# EAGLE design stm32f103c8_stlink (EAGLE 7.6.0)
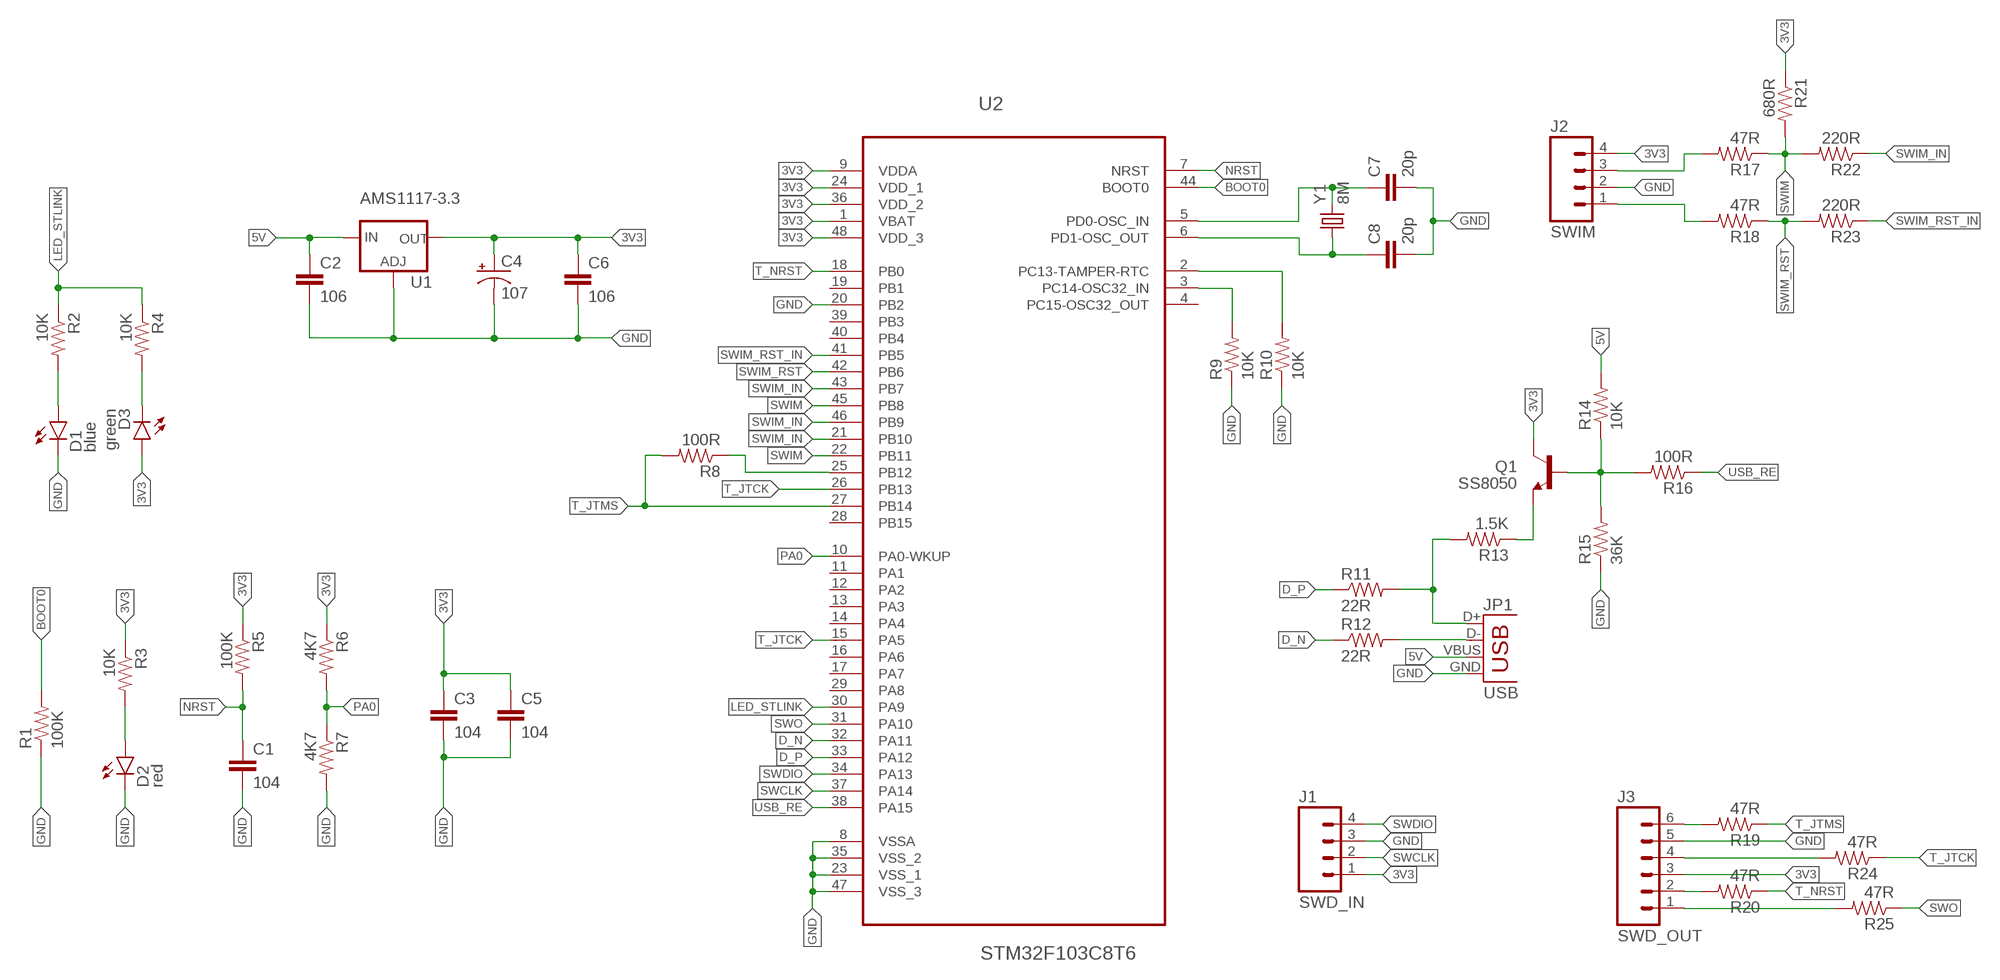
[diagram p0: schematic, sheet 1]

## Parts
C1  104  CAP0603-CAP  [0603-CAP]
C2  106  CAP0603-CAP  [0603-CAP]
C3  104  CAP0603-CAP  [0603-CAP]
C4  107  CAP_POL3528  [EIA3528]
C5  104  CAP0603-CAP  [0603-CAP]
C6  106  CAP0603-CAP  [0603-CAP]
C7  20p  CAP0603-CAP  [0603-CAP]
C8  20p  CAP0603-CAP  [0603-CAP]
D1  blue  LED-SEEED-0603  [LED-0603-SEEED]
D2  red  LED-SEEED-0603  [LED-0603-SEEED]
D3  green  LED-SEEED-0603  [LED-0603-SEEED]
J1  SWD_IN  M041X04_NO_SILK  [1X04_NO_SILK]
J2  SWIM  M041X04_NO_SILK  [1X04_NO_SILK]
J3  SWD_OUT  M06NO_SILK_FEMALE_PTH  [1X06_NO_SILK]
JP1  USB  [MICROUSB-U-F-M5DD-Y-1]
Q1  SS8050  TRANSISTOR_NPN-JLC-SMT  [SOT23-3]
R1  100K  RESISTOR0603  [0603-RES]
R2  10K  RESISTOR0603  [0603-RES]
R3  10K  RESISTOR0603  [0603-RES]
R4  10K  RESISTOR0603  [0603-RES]
R5  100K  RESISTOR0603  [0603-RES]
R6  4K7  RESISTOR0603  [0603-RES]
R7  4K7  RESISTOR0603  [0603-RES]
R8  100R  RESISTOR0603  [0603-RES]
R9  10K  RESISTOR0603  [0603-RES]
R10  10K  RESISTOR0603  [0603-RES]
R11  22R  RESISTOR0603  [0603-RES]
R12  22R  RESISTOR0603  [0603-RES]
R13  1.5K  RESISTOR0603  [0603-RES]
R14  10K  RESISTOR0603  [0603-RES]
R15  36K  RESISTOR0603  [0603-RES]
R16  100R  RESISTOR0603  [0603-RES]
R17  47R  RESISTOR0603  [0603-RES]
R18  47R  RESISTOR0603  [0603-RES]
R19  47R  RESISTOR0603  [0603-RES]
R20  47R  RESISTOR0603  [0603-RES]
R21  680R  RESISTOR0603  [0603-RES]
R22  220R  RESISTOR0603  [0603-RES]
R23  220R  RESISTOR0603  [0603-RES]
R24  47R  RESISTOR0603  [0603-RES]
R25  47R  RESISTOR0603  [0603-RES]
U1  AMS1117-3.3  AMS1117SOT223  [SOT223]
U2  STM32F103C8T6  STM32F103CBT6  [LQFP-48]
Y1  8M  CRYSTALHC49US  [HC49US]

## Nets
3V3: C3.1 C4.A(+) C5.1 C6.1 D3.+(A) J1.1 J2.4 J3.3 Q1.3(C) R3.1 R5.1 R6.1 R21.1 U1.2(OUT) U1.4(OUT) U2.1(VBAT) U2.9(VDDA) U2.24(VDD_1) U2.36(VDD_2) U2.48(VDD_3)
5V: C2.1 JP1.VBUS R14.2 U1.3(IN)
BOOT0: R1.2 U2.44(BOOT0)
D_N: R12.1 U2.32(PA11)
D_P: R11.1 U2.33(PA12)
GND: C1.2 C2.2 C3.2 C4.C(-) C5.2 C6.2 C7.2 C8.2 D1.-(C) D2.-(C) J1.3 J2.2 J3.5 JP1.GND R1.1 R7.2 R9.1 R10.1 R15.1 U1.1(ADJ) U2.8(VSSA) U2.20(PB2) U2.23(VSS_1) U2.35(VSS_2) U2.47(VSS_3)
LED_STLINK: R2.1 R4.1 U2.30(PA9)
N$1: J3.6 R19.2
N$2: J2.3 R17.2
N$3: C7.1 U2.5(PD0-OSC_IN) Y1.2
N$4: C8.1 U2.6(PD1-OSC_OUT) Y1.1
N$5: D2.+(A) R3.2
N$6: Q1.2(E) R13.1
N$7: D1.+(A) R2.2
N$8: R10.2 U2.2(PC13-TAMPER-RTC)
N$9: R9.2 U2.3(PC14-OSC32_IN)
N$10: D3.-(C) R4.2
N$11: Q1.1(B) R14.1 R15.2 R16.2
N$12: R8.1 U2.25(PB12)
N$14: J2.1 R18.2
N$15: J3.4 R24.2
N$17: J3.2 R20.2
N$18: J3.1 R25.2
NRST: C1.1 R5.2 U2.7(NRST)
PA0: R6.2 R7.1 U2.10(PA0-WKUP)
SWCLK: J1.2 U2.37(PA14)
SWDIO: J1.4 U2.34(PA13)
SWIM: R17.1 R21.2 R22.2 U2.22(PB11) U2.45(PB8)
SWIM_IN: R22.1 U2.21(PB10) U2.43(PB7) U2.46(PB9)
SWIM_RST: R18.1 R23.2 U2.42(PB6)
SWIM_RST_IN: R23.1 U2.41(PB5)
SWO: R25.1 U2.31(PA10)
T_JTCK: R24.1 U2.15(PA5) U2.26(PB13)
T_JTMS: R8.2 R19.1 U2.27(PB14)
T_NRST: R20.1 U2.18(PB0)
USB_N [diffpair]: JP1.D- R12.2
USB_P [diffpair]: JP1.D+ R11.2 R13.2
USB_RE: R16.1 U2.38(PA15)
Unconnected: U2.4(PC15-OSC32_OUT) U2.11(PA1) U2.12(PA2) U2.13(PA3) U2.14(PA4) U2.16(PA6) U2.17(PA7) U2.19(PB1) U2.28(PB15) U2.29(PA8) U2.39(PB3) U2.40(PB4)

## Library data of the parts
C1-C3 C5-C8 = z_jlc_smt:CAP: Capacitor Standard 0603 ceramic capacitor, and 0.1" leaded capacitor.
C4 = z_jlc_smt:CAP_POL: Capacitor Polarized These are standard SMD and PTH capacitors. Normally 10uF, 47uF, and 100uF in electrolytic and tantalum varieties. Always verify the external diameter of the through hole cap, it varies with capacity, voltage, and manufacturer. The EIA devices should be standard.
D1-D3 = z_jlc_smt:LED: LEDs Standard schematic elements and footprints for 5mm, 3mm, 1206, and 0603 sized LEDs. 5mm - Spark Fun Electronics SKU : COM-00529 (and others)
J1 J2 = SparkFun-Connectors:M04: Header 4 Standard 4-pin 0.1" header. Use with straight break away headers (SKU : PRT-00116), right angle break away headers (PRT-00553), swiss pins (PRT-00743), machine pins (PRT-00117), and female headers (PRT-00115). Molex polarized connector foot print use with SKU : PRT-08231 with associated crimp pins and housings. 1MM SMD Version SKU: PRT-10208; PROD_ID: CONN-09696
J3 = SparkFun-Connectors:M06: Header 6 Standard 6-pin 0.1" header. Use with straight break away headers (SKU : PRT-00116), right angle break away headers (PRT-00553), swiss pins (PRT-00743), machine pins (PRT-00117), and female headers (PRT-00115). Molex polarized connector foot print use with SKU : PRT-08094 with associated crimp pins and housings. NOTES ON THE VARIANTS LOCK and LOCK_LONGPADS... This footprint was designed to help hold the alignment of a through-hole component (i.e. 6-pin header) while soldering it into place. You may notice that each hole has been shifted either up or down by 0.005 of an inch from it's more standard position (which is a perfectly straight line). This slight alteration caused the pins (the squares in the middle) to touch the edges of the holes. Because they are alternating, it causes a "brace" to hold the component in place. 0.005 has proven to be the perfect amount of "off-center" position when using our standard breakaway headers. Although looks a little odd when you look at the bare footprint, once you have a header in there, the alteration is very hard to notice. Also,if you push a header all the way into place, it is covered up entirely on the bottom side. This idea of altering the position of holes to aid alignment will be further integrated into the Sparkfun Library for other footprints. It can help hold any component with 3 or more connection pins.; PROD_ID: CONN-08437
JP1 = xmgu2008:USB: USB Connectors USB-B-PTH is fully proven SKU : PRT-00139/CONN-08278 USB-miniB is fully proven SKU : PRT-00587 USB-A-PCB is untested. USB-A-H is throughly reviewed, but untested. Spark Fun Electronics SKU : PRT-00437 USB-B-SMT is throughly reviewed, but untested. Needs silkscreen touching up. USB-A-S has not been used/tested USB-MB-H has not been used/tested USB-MICROB has been used. CONN-09505
Q1 = z_jlc_smt:TRANSISTOR_NPN: Generic NPN BJT MMBT2222A - TRANS-08049 (SOT-23, 1A 40V) MPSA42 - TRANS-09116 (SOT-23, 500mA 300V) MMBT5088LT1G - TRANS-11160 (SOT-23, 50 mA 30V) BC547 - COM-08928 <http://www.sparkfun.com/products/8928> (TO-92 45V 100mA) (1.Collector 2.Base 3.Emitter) 2N3904 - COM-00521 <http://www.sparkfun.com/products/521> (TO-92 40V 200mA) (1.Emitter 2.Base 3.Collector) P2N2222A - COM-12852 <http://www.sparkfun.com/products/12852> (TO-92 40V 600mA) (1.Collector 2.Base 3.Emitter)
R1-R25 = z_jlc_smt:RESISTOR: Resistor Basic schematic elements and footprints for 0603, 1206, and PTH resistors.
U1 = z_jlc_smt:AMS1117: Voltage Regulator AMS1117; PROD_ID: VREG-08170
U2 = z_jlc_smt:STM32F103CBT6: Medium-density performance line ARM-based 32-bit MCU; MPN: STM32F103CBT6; OC_FARNELL: 1606327; OC_NEWARK: 11N8296; PACKAGE: QFP-48; SUPPLIER: STMICROELECTRONICS
Y1 = xmgu2008:CRYSTAL: Various standard crystals. Proven footprints.

## Net classes
1 diffpair: width 0.178 mm

## Board
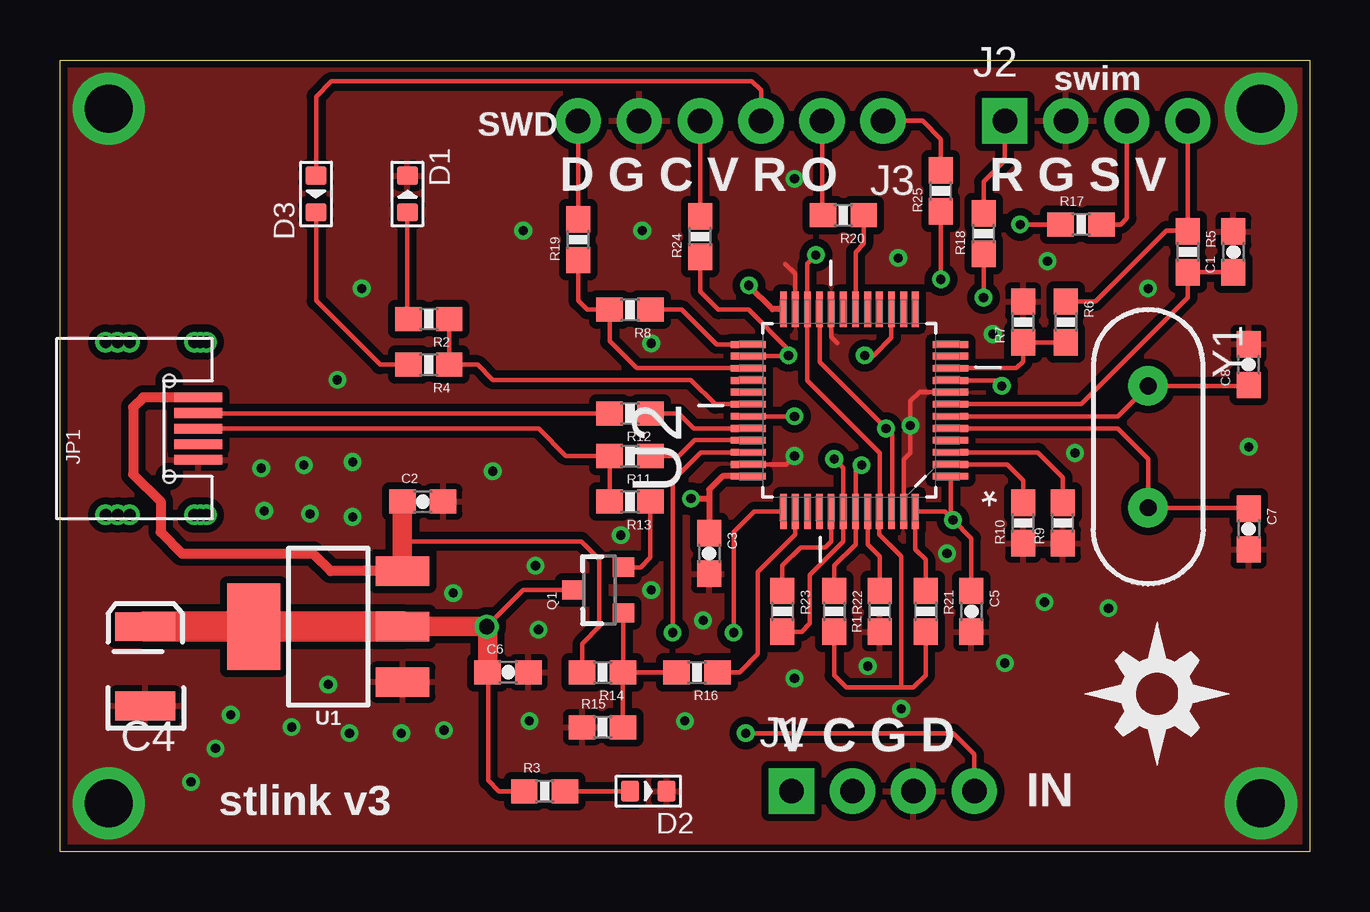
[diagram p1: board, top side]
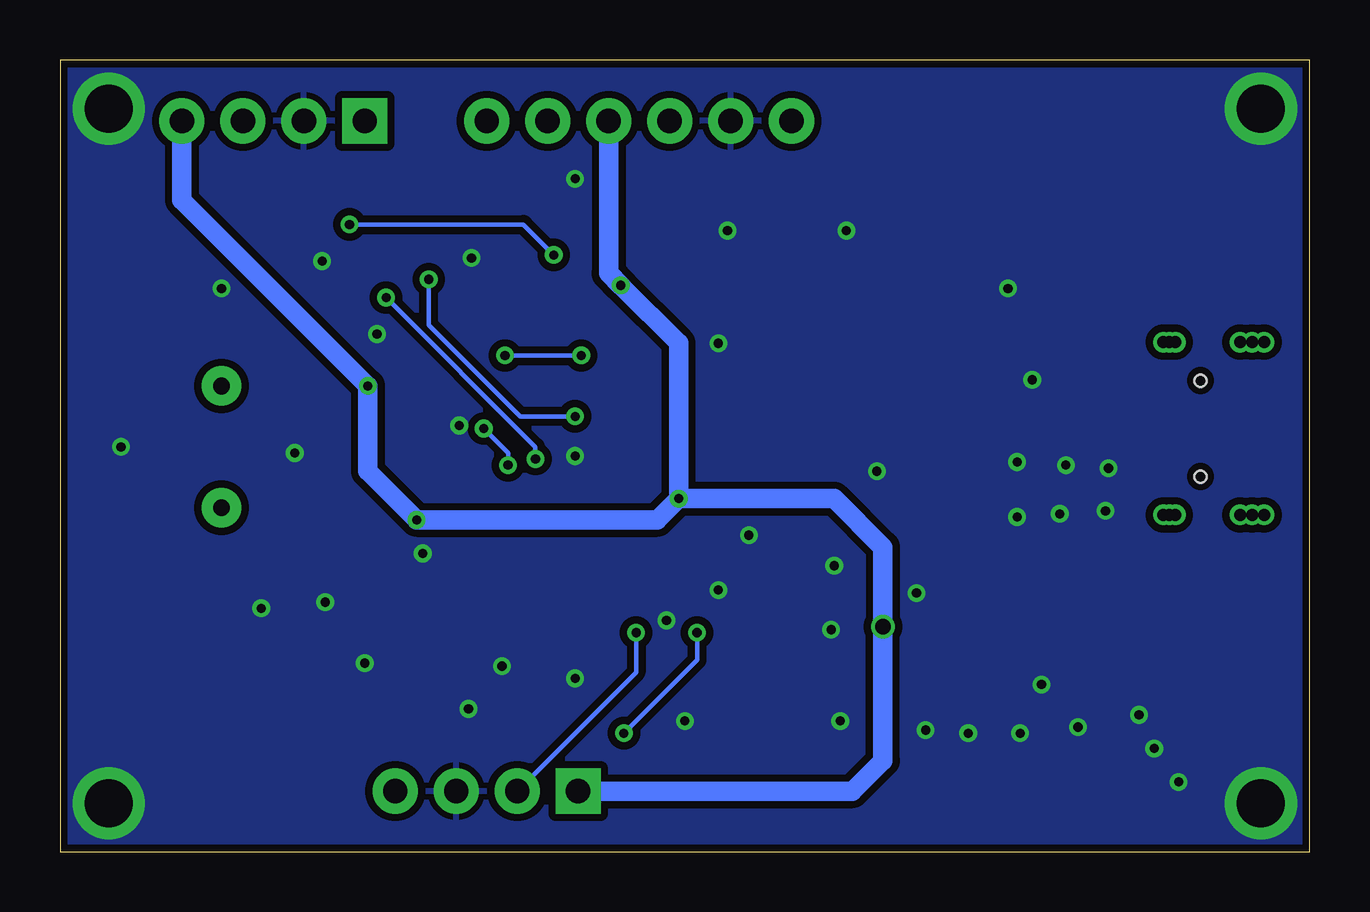
[diagram p2: board, bottom side, seen from below]

Size 52.07 x 33.02 mm. Coordinates in mm from the lower left corner, seen from the top.
Outline: 0,0 0,33.02 52.07,33.02 52.07,0 0,0
Copper layers (1*16): Top 0.035mm / dielectric 1.5mm / Bottom 0.035mm
Design rules "SparkFun-2-layer-TIGHT": minimum track width 7mil, minimum drill 15mil, track to track 7mil, track to pad 7mil, pad to pad 7mil, via to via 7mil, smd to smd 7mil, copper to edge 7mil, drill to drill 7mil, minimum pad ring 7mil, minimum via ring 7mil, stop-mask expansion 4mil, vias tented up to drill 20mil, thermal gap 10mil

### Footprints (pad centres in the part's own frame; a part is rotated, then mirrored left to right if it is on the bottom)
0603-CAP = smd 1.1 x 1: 1 -0.85,0; 2 0.85,0
EIA3528 = smd 1.2 x 2.5: A 1.65,0; C -1.65,0
LED-0603-SEEED = smd 0.762 x 0.889: + 0.762,0; - -0.762,0
1X04_NO_SILK = drill 1.016 pad 1.88 square: 1 0,0 | drill 1.016 pad 1.88: 2 2.54,0; 3 5.08,0; 4 7.62,0
1X06_NO_SILK = drill 1.016 pad 1.88: 1 0,0; 2 2.54,0; 3 5.08,0; 4 7.62,0; 5 10.16,0; 6 12.7,0
MICROUSB-U-F-M5DD-Y-1 = drill 0.5: 6_1 3.6,0.25; 6_2 3.6,0.5; 6_3 3.6,0.75; 7_1 3.6,3.45; 7_2 3.6,3.95; 7_3 3.6,4.45; 8_1 -3.6,4.45; 8_2 -3.6,3.95; 8_3 -3.6,3.45; 9_1 -3.6,0.75; 9_2 -3.6,0.5; 9_3 -3.6,0.25 | smd 0.4 x 2: D+ 0,0.6; D- 0.65,0.6; GND -1.3,0.6; ID -0.65,0.6; VBUS 1.3,0.6 | hole 0.5: -2,1.8; 2,1.8
SOT23-3 = smd 0.9 x 0.8: 1 1,-0.95; 2 1,0.95; 3 -1.1,0
0603-RES = smd 1.1 x 1: 1 -0.85,0; 2 0.85,0
SOT223 = smd 2.235 x 1.219: 1 3.099,-2.311; 2 3.099,0; 3 3.099,2.311 | smd 2.2 x 3.6: 4 -3.099,0
LQFP-48 = smd 0.279 x 1.473: 1 -2.743,-4.216; 2 -2.261,-4.216; 3 -1.753,-4.216; 4 -1.245,-4.216; 5 -0.762,-4.216; 6 -0.254,-4.216; 7 0.254,-4.216; 8 0.762,-4.216; 9 1.245,-4.216; 10 1.753,-4.216; 11 2.261,-4.216; 12 2.743,-4.216; 25 2.743,4.216; 26 2.261,4.216; 27 1.753,4.216; 28 1.245,4.216; 29 0.762,4.216; 30 0.254,4.216; 31 -0.254,4.216; 32 -0.762,4.216; 33 -1.245,4.216; 34 -1.753,4.216; 35 -2.261,4.216; 36 -2.743,4.216 | smd 1.473 x 0.279: 13 4.216,-2.743; 14 4.216,-2.261; 15 4.216,-1.753; 16 4.216,-1.245; 17 4.216,-0.762; 18 4.216,-0.254; 19 4.216,0.254; 20 4.216,0.762; 21 4.216,1.245; 22 4.216,1.753; 23 4.216,2.261; 24 4.216,2.743; 37 -4.216,2.743; 38 -4.216,2.261; 39 -4.216,1.753; 40 -4.216,1.245; 41 -4.216,0.762; 42 -4.216,0.254; 43 -4.216,-0.254; 44 -4.216,-0.762; 45 -4.216,-1.245; 46 -4.216,-1.753; 47 -4.216,-2.261; 48 -4.216,-2.743
HC49US = drill 0.7 pad 1.651: 1 -2.54,0; 2 2.54,0

### Placement (x,y rotation side)
C1  48.9,25.02 90 top
C2  15.11,14.61 0 top
C3  27.05,12.45 270 top
C4  3.56,7.75 90 top
C5  37.97,10.03 270 top
C6  18.67,7.49 0 top
C7  49.53,13.46 270 top
C8  49.53,20.32 90 top
D1  14.48,27.43 270 top
D2  24.51,2.54 180 top
D3  10.67,27.43 90 top
J1  30.48,2.54 0 top
J2  39.37,30.48 0 top
J3  34.29,30.48 180 top
JP1  6.35,17.65 90 top
Q1  22.48,10.92 0 top
R1  34.16,10.03 90 top
R2  15.37,22.23 180 top
R3  20.19,2.54 0 top
R4  15.37,20.32 180 top
R5  46.99,25.02 270 top
R6  41.91,22.1 270 top
R7  40.13,22.1 90 top
R8  23.75,22.61 180 top
R9  41.78,13.72 90 top
R10  40.13,13.72 90 top
R11  23.75,16.51 180 top
R12  23.75,18.29 180 top
R13  23.75,14.61 180 top
R14  22.61,7.49 180 top
R15  22.61,5.21 0 top
R16  26.54,7.49 180 top
R17  42.55,26.16 0 top
R18  38.48,25.78 90 top
R19  21.59,25.53 90 top
R20  32.64,26.54 180 top
R21  36.07,10.03 270 top
R22  32.26,10.03 270 top
R23  30.1,10.03 270 top
R24  26.67,25.65 90 top
R25  36.7,27.56 90 top
U1  11.18,9.4 0 top
U2  32.89,18.41 90 top
U$1  [DIYNOVA_LOGO]  42.67,3.56 0 top
Y1  45.34,16.89 270 top

### Tracks (layer width: path | path; a pad name or v marks a point on that pad's centre or on a via)
3V3  (via drill 0.38, 0.64)
  Top 0.178: J3.3 29.21,31.75 28.83,32.13 11.3,32.13 10.67,31.5 D3.+ | J2.4 R5.1 46.95,25.91 46.1,25.91 43.14,22.95 R6.1 | U2.9 39.01,19.66 v39.24,19.43 | R21.1 36.07,12.19 35.64,12.62 U2.48 36.85,14.2 v37.21,13.84 | C5.1 37.97,13.08 v37.21,13.84 | U2.1 37.11,13.95 v37.21,13.84 | Q1.3 19.3,10.92 v17.78,9.4 | C6.1 17.84,7.47 17.84,2.98 18.29,2.54 R3.1
  Top 0.254: 27.05,14.73 27.05,15.11 27.61,15.67 U2.36 | 27.05,14.73 C3.1 | v28.7,23.62 29.69,22.63 U2.24 | v26.29,14.73 27.05,14.73
  Top 0.813: U1.2 v17.78,9.4 17.82,9.36 C6.1
  Top 1.27: C4.A U1.4 U1.2
  Bottom 0.813: v26.29,14.73 26.29,21.21 v28.7,23.62 29.21,24.13 J3.3 | v26.29,14.73 27.18,13.84 v37.21,13.84 39.24,15.88 v39.24,19.43 46.99,27.18 J2.4 | v26.29,14.73 19.81,14.73 17.78,12.7 v17.78,9.4 17.78,3.81 19.05,2.54 J1.1
5V
  Top 0.178: R14.2 21.76,8.68 22.48,9.4 22.48,12.19 21.72,12.95 14.26,12.95
  Top 0.406: JP1.VBUS 3.46,18.95 3.05,18.54 3.05,15.75 4.19,14.61 4.19,13.34 5.08,12.45 10.54,12.45 11.28,11.71 U1.3
  Top 0.813: C2.1 14.26,12.95 U1.3
BOOT0
  Top 0.178: U2.44 33.66,12.83 34.16,12.32 R1.2
D_N
  Top 0.178: U2.32 26.41,17.65 25.78,18.29 R12.1
D_P
  Top 0.178: U2.33 26.44,17.17 25.78,16.51 R11.1
GND  (via drill 0.38, 2.01)
  Top 0.178: U2.47 35.15,16.36 35.43,16.64 v35.43,17.78 35.43,18.8 35.81,19.18 U2.8 | U2.23 30.63,24.11 30.23,24.51 | U2.20 32.13,21.46 32.38,21.21 | U2.35 30.25,16.15 v30.61,16.51
  other vias: 2.03,30.99 2.03,2.03 50.04,2.03 50.04,30.99 24.64,10.92 30.61,7.24 35.05,5.97 11.56,19.68 19.3,25.91 24.26,25.91 49.53,16.89 43.69,10.16 45.34,23.5 24.64,21.21 33.66,7.75 39.37,7.87 26.8,9.65 30.61,28.07 41.15,24.64 38.86,21.59 42.29,16.64 36.96,12.45 19.94,9.27 19.56,5.46 26.04,5.46 11.18,6.99 12.57,23.5 34.92,24.77 8.38,16 10.16,16.13 12.19,16.26 12.19,13.97 10.41,14.1 8.51,14.22 18.03,15.88 16.38,10.79 14.22,4.95 16,5.08 9.65,5.21 12.06,4.95 7.11,5.71 6.48,4.32 5.46,2.92 41.02,10.41 19.81,11.94 23.37,13.21
  pour Top (isolate 0.305): 0,0 0,33.02 52.07,33.02 52.07,0
  pour Bottom (isolate 0.305): 0,0 0,33.02 52.07,33.02 52.07,0
LED_STLINK
  Top 0.178: R2.1 R4.1 17.4,20.32 18.03,19.68 26.29,19.68 27.3,18.67 U2.30
N$1
  Top 0.178: R19.2 J3.6
N$2
  Top 0.178: R17.2 44.2,26.16 44.45,26.42 J2.3
N$3
  Top 0.178: U2.5 44.07,17.65 45.34,16.38 Y1.2 49.49,14.35 C7.1
N$4
  Top 0.178: U2.6 44.07,18.16 Y1.1 49.49,19.43 C8.1
N$5
  Top 0.178: R3.2 D2.+
N$6
  Top 0.178: Q1.2 24.19,11.87 24.6,12.28 R13.1
N$7
  Top 0.178: R2.2 14.48,22.26 D1.+
N$8
  Top 0.178: U2.2 39.47,16.15 40.13,15.49 R10.2
N$9
  Top 0.178: U2.3 40.74,16.66 41.78,15.62 R9.2
N$10
  Top 0.178: R4.2 13.34,20.32 10.67,22.99 D3.-
N$11
  Top 0.178: R16.2 R14.1 | R15.2 R14.1 | Q1.1 23.48,7.52 R14.1
N$12
  Top 0.178: U2.25 27.36,21.16 25.91,22.61 R8.1
N$14
  Top 0.178: J2.1 39.37,28.83 38.48,27.94 R18.2
N$15
  Top 0.178: R24.2 J3.4
N$17
  Top 0.178: J3.2 31.75,26.58 R20.2
N$18
  Top 0.178: J3.1 35.94,30.48 36.7,29.72 R25.2
NRST
  Top 0.178: U2.7 42.55,18.67 46.99,23.11 R5.2 C1.1
PA0
  Top 0.178: R6.2 R7.1 40.13,20.45 39.85,20.17 U2.10
SWCLK  (via drill 0.38)
  Top 0.178: U2.37 28.93,14.2 28.07,13.34 v28.07,9.14
  Bottom 0.178: v28.07,9.14 28.07,7.49 J1.2
SWDIO  (via drill 0.38)
  Top 0.178: U2.34 26.7,16.66 25.53,15.49 v25.53,9.14 | v28.57,4.95 37.21,4.95 38.1,4.06 J1.4
  Bottom 0.178: v28.57,4.95 25.53,8 v25.53,9.14
SWIM  (via drill 0.38)
  Top 0.178: R22.2 32.26,7.37 32.77,6.86 35.05,6.86 | 35.05,6.86 35.05,12.32 34.14,13.23 U2.45 34.16,14.22 34.16,16.64 31.14,19.66 U2.22 31.14,24.54 v31.5,24.89 | 35.05,6.86 35.56,6.86 36.07,7.37 R21.2 | R17.1 v40.01,26.16
  Bottom 0.178: v40.01,26.16 32.77,26.16 v31.5,24.89
SWIM_IN  (via drill 0.38)
  Top 0.178: R22.1 32.26,11.94 33.15,12.83 U2.43 33.15,15.88 v33.4,16.13 | U2.46 34.67,14.22 34.67,17.4 v34.42,17.65 31.65,20.42 U2.21
  Bottom 0.178: v33.4,16.13 33.4,16.64 v34.42,17.65
SWIM_RST  (via drill 0.38)
  Top 0.178: R23.2 30.9,9.18 31.24,9.53 31.24,11.56 32.64,12.95 U2.42 32.64,16 v32.26,16.38 | R18.1 v38.48,23.11
  Bottom 0.178: v32.26,16.38 32.26,16.89 v38.48,23.11
SWIM_RST_IN
  Top 0.178: U2.41 32.13,12.95 31.88,12.7 30.86,12.7 30.1,11.94 R23.1
SWO  (via drill 0.38)
  Top 0.178: 36.66,26.67 R25.1 v36.7,23.88 | v30.61,18.16 U2.31
  Bottom 0.178: v30.61,18.16 32.89,18.16 36.7,21.97 v36.7,23.88
T_JTCK  (via drill 0.38)
  Top 0.178: U2.15 34.65,21.44 33.91,20.7 v33.53,20.7 | R24.1 26.67,23.37 27.43,22.61 28.7,22.61 30.35,20.95 v30.35,20.7 30.33,20.68 U2.26
  Bottom 0.178: v33.53,20.7 v30.35,20.7
T_JTMS
  Top 0.178: U2.27 24.03,20.17 22.9,21.3 R8.2 21.97,22.61 21.59,22.99 R19.1
T_NRST
  Top 0.178: U2.18 33.15,25.02 33.49,25.36 R20.1
USB_N
  Top 0.178: R12.2 5.76,18.29 JP1.D-
USB_P
  Top 0.178: R13.2 R11.2 21.08,16.51 19.94,17.65 JP1.D+
USB_RE
  Top 0.178: U2.38 30.63,13.23 29.08,11.68 29.08,8.26 28.32,7.49 R16.1

### Text on the board
tPlace: swim | SWD | D G C V R O | R G S V | V C G D | stlink v3 | IN